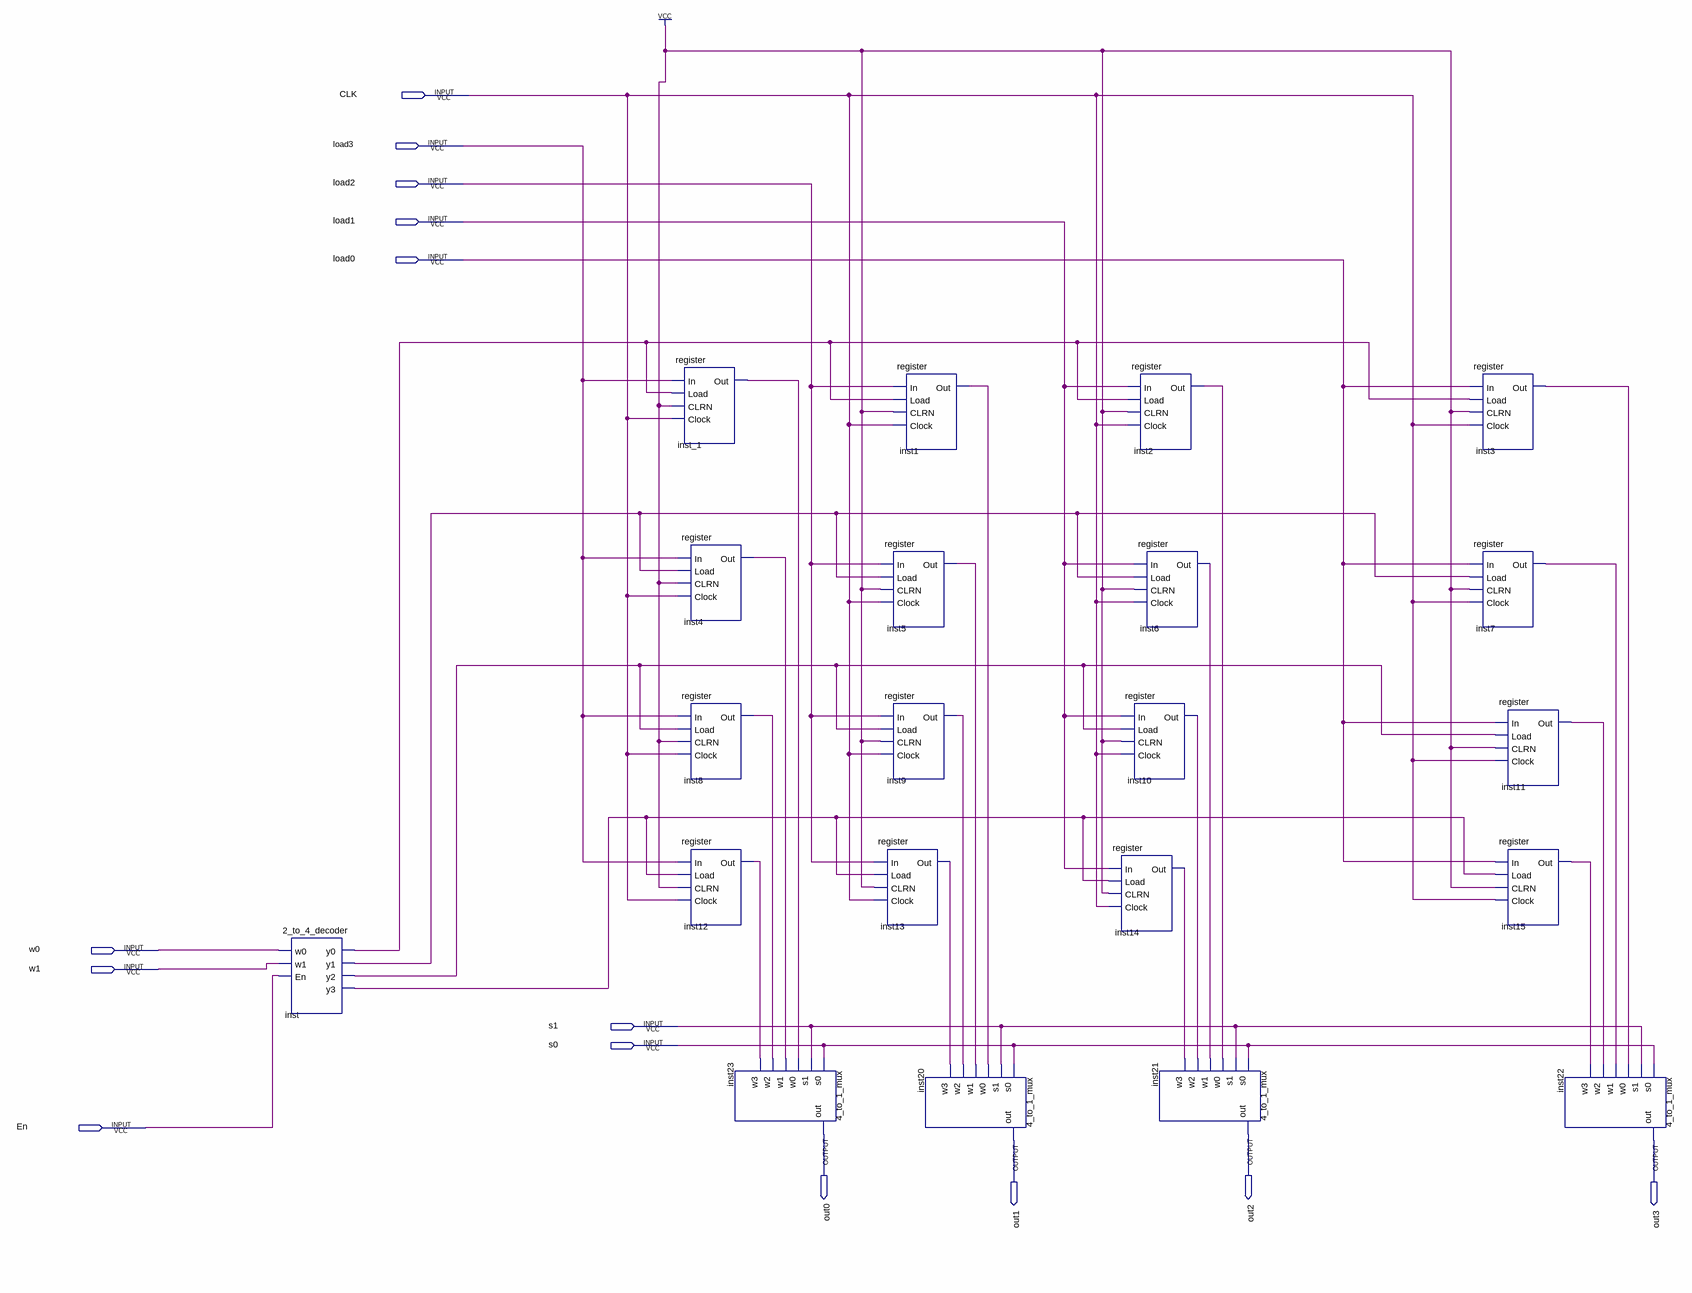
[diagram p0: schematic sheet]
// Quartus schematic register_file.bdf as structural Verilog: 21 symbols, 14 pins
module register_file (
  input  CLK,
  input  load3,
  input  load2,
  input  load1,
  input  load0,
  input  w0,
  input  w1,
  input  s1,
  input  s0,
  input  En,
  output out0,
  output out2,
  output out1,
  output out3
);

  wire inst1_out, inst2_out, inst3_out, inst4_out, inst5_out, inst6_out, inst7_out, inst8_out, inst9_out,
       inst10_out, inst11_out, inst12_out, inst13_out, inst14_out, inst15_out, inst_1_out, inst_y0, inst_y1,
       inst_y2, inst_y3;

  \2_to_4_decoder  inst (.w0(w0), .w1(w1), .En(En), .y0(inst_y0), .y1(inst_y1), .y2(inst_y2), .y3(inst_y3));
  register inst_1 (.In(load3), .Load(inst_y0), .CLRN(1'b1), .Clock(CLK), .Out(inst_1_out));
  register inst4 (.In(load3), .Load(inst_y1), .CLRN(1'b1), .Clock(CLK), .Out(inst4_out));
  register inst8 (.In(load3), .Load(inst_y2), .CLRN(1'b1), .Clock(CLK), .Out(inst8_out));
  register inst12 (.In(load3), .Load(inst_y3), .CLRN(1'b1), .Clock(CLK), .Out(inst12_out));
  \4_to_1_mux  inst23 (.s0(s0), .s1(s1), .w0(inst_1_out), .w1(inst4_out), .w2(inst8_out), .w3(inst12_out), .out(out0));
  register inst5 (.In(load2), .Load(inst_y1), .CLRN(1'b1), .Clock(CLK), .Out(inst5_out));
  register inst9 (.In(load2), .Load(inst_y2), .CLRN(1'b1), .Clock(CLK), .Out(inst9_out));
  register inst13 (.In(load2), .Load(inst_y3), .CLRN(1'b1), .Clock(CLK), .Out(inst13_out));
  register inst1 (.In(load2), .Load(inst_y0), .CLRN(1'b1), .Clock(CLK), .Out(inst1_out));
  \4_to_1_mux  inst20 (.s0(s0), .s1(s1), .w0(inst1_out), .w1(inst5_out), .w2(inst9_out), .w3(inst13_out), .out(out1));
  register inst2 (.In(load1), .Load(inst_y0), .CLRN(1'b1), .Clock(CLK), .Out(inst2_out));
  register inst6 (.In(load1), .Load(inst_y1), .CLRN(1'b1), .Clock(CLK), .Out(inst6_out));
  register inst10 (.In(load1), .Load(inst_y2), .CLRN(1'b1), .Clock(CLK), .Out(inst10_out));
  register inst14 (.In(load1), .Load(inst_y3), .CLRN(1'b1), .Clock(CLK), .Out(inst14_out));
  \4_to_1_mux  inst21 (.s0(s0), .s1(s1), .w0(inst2_out), .w1(inst6_out), .w2(inst10_out), .w3(inst14_out), .out(out2));
  register inst3 (.In(load0), .Load(inst_y0), .CLRN(1'b1), .Clock(CLK), .Out(inst3_out));
  register inst7 (.In(load0), .Load(inst_y1), .CLRN(1'b1), .Clock(CLK), .Out(inst7_out));
  register inst11 (.In(load0), .Load(inst_y2), .CLRN(1'b1), .Clock(CLK), .Out(inst11_out));
  register inst15 (.In(load0), .Load(inst_y3), .CLRN(1'b1), .Clock(CLK), .Out(inst15_out));
  \4_to_1_mux  inst22 (.s0(s0), .s1(s1), .w0(inst3_out), .w1(inst7_out), .w2(inst11_out), .w3(inst15_out), .out(out3));
endmodule
